# Altium schematic sheet audio_filter.SchDoc
size A3; SheetNumber: 6; SheetTotal: 7
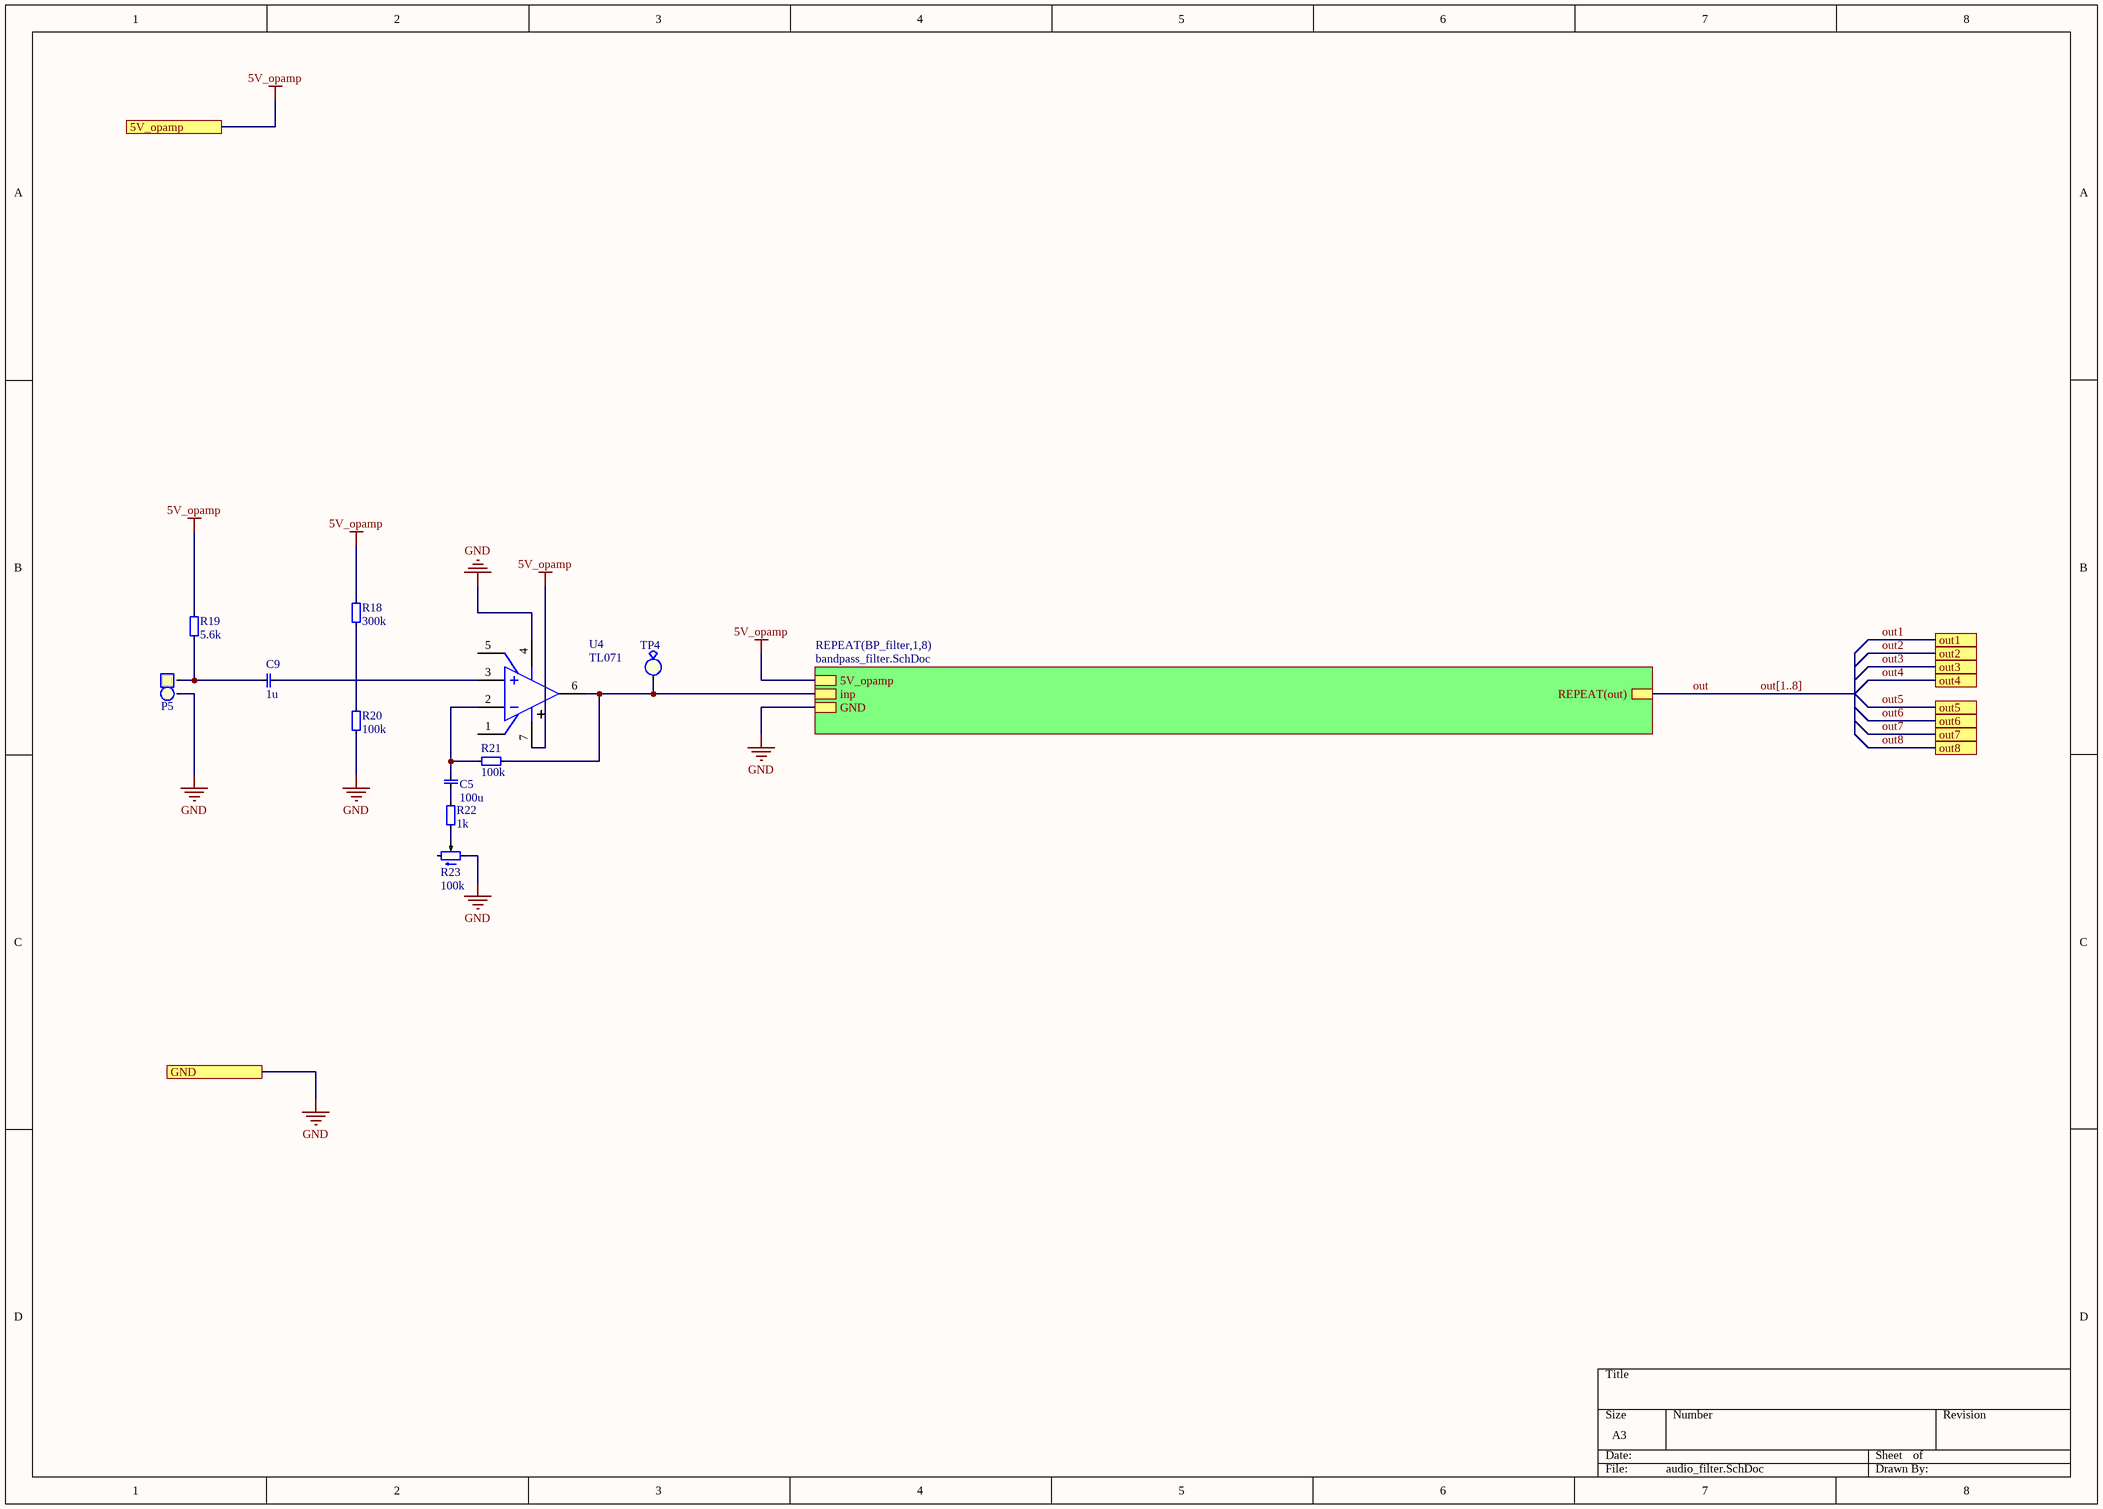
[diagram p0: audio_filter.SchDoc]

## Parts
C5  value 100u  [1206, capasitor]  (hidden comment: 1206, capacitor)
C9  value 1u  [1206, capasitor]  (hidden comment: 1206, capacitor)
P5  1x2 Pin Header  [padtwo_L]  (value not drawn)
R18  value 300k  [1206]  (hidden comment: 1206, resistor)
R19  value 5.6k  [1206]  (hidden comment: 1206, resistor)
R20  value 100k  [1206]  (hidden comment: 1206, resistor)
R21  value 100k  [1206]  (hidden comment: 1206, resistor)
R22  value 1k  [1206]  (hidden comment: 1206, resistor)
R23  value 100k  [POT_TH1]  (hidden comment: Pot)
TP4  Test Point  [testPoint]  (value not drawn)
U4  TL071  [SOIC8]

## Sub-sheets
REPEAT(BP_filter,1,8) = bandpass_filter.SchDoc: 5V_opamp, inp, GND, REPEAT(out)

## Ports
5V_opamp, GND, out1, out2, out3, out4, out5, out6, out7, out8

## Nets
5V_opamp: R18.0 R19.0 U4.7(V+) ; port 5V_opamp, sheet REPEAT(BP_filter,1,8)/5V_opamp
GND: P5.2 R20.1 R23.1 U4.4(V-) ; port GND, sheet REPEAT(BP_filter,1,8)/GND
out: sheet REPEAT(BP_filter,1,8)/REPEAT(out)
out1: port out1
out2: port out2
out3: port out3
out4: port out4
out5: port out5
out6: port out6
out7: port out7
out8: port out8
NetC5_0: C5.0 R21.0 U4.2(IN-)
NetC5_1: C5.1 R22.0
NetC9_0: C9.0 U4.3(IN+)
NetC9_1: C9.1 P5.1 R19.1
NetR18_1: R18.1 R20.0
NetR21_1: R21.1 TP4.0 U4.6(OUT) ; sheet REPEAT(BP_filter,1,8)/inp
NetR22_1: R22.1 R23.2

Not connected (* = marked no-connect by the designer): R23 3; U4 1(OS_TRIM) 5(OS_TRIM)

## Buses and harness runs
bus out[1..8]

## Library data of the parts
P5 = 1x2 Pin Header: 2.54 mm, TH; Value: 1x2 Pin Header
R18-R22 = 1206, resistor: Resistor
  R18: DigiKey: RMCF1206FT300KCT-ND
  R19: DigiKey: RMCF1206JT5K60CT-ND
  R20 R21: DigiKey: RMCF1206JT100KCT-ND
  R22: DigiKey: RPC1206JT1K00CT-ND
C5 C9 = 1206, capacitor
  C5: DigiKey: 13-CC1206MKX5R5BB107CT-ND
  C9: DigiKey: 478-12816-1-ND
R23 = Pot: DigiKey: 3362R-1-104LF
TP4 = Test Point: Value: Test point; Farnell: 1702006
U4 = TL071: Digikey: 296-15001-1-ND